# Altium schematic sheet Sheet1.SchDoc
size A; SheetNumber: 1; SheetTotal: 2
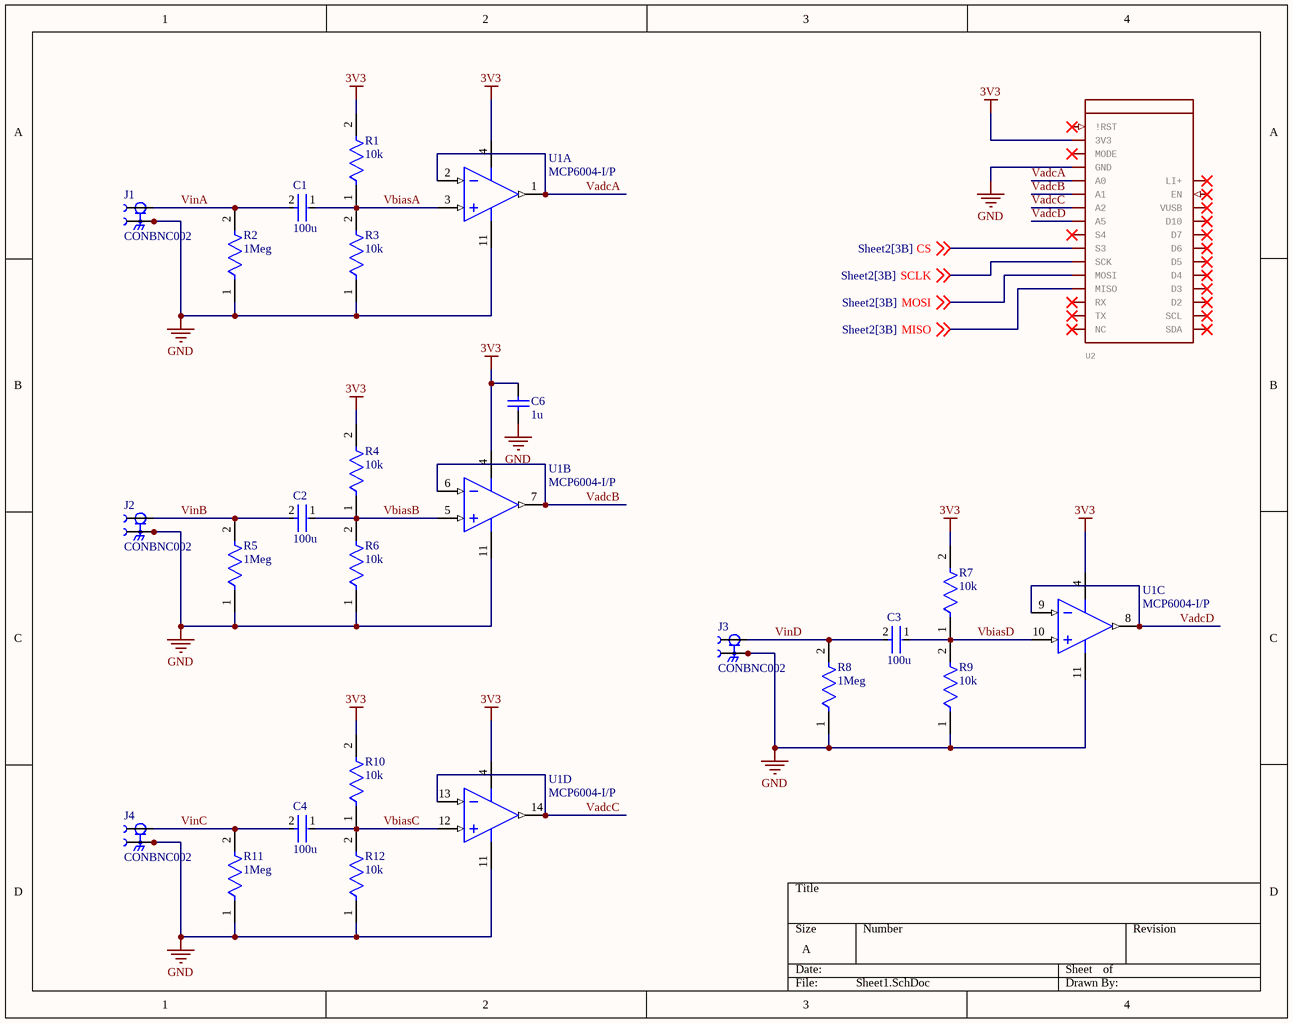
[diagram p0: Sheet1.SchDoc]

## Parts
C1  100u  [FP-GRM31C-0_3-e0_3_0_8-IPC_C]
C2  100u  [FP-GRM31C-0_3-e0_3_0_8-IPC_C]
C3  100u  [FP-GRM31C-0_3-e0_3_0_8-IPC_C]
C4  100u  [FP-GRM31C-0_3-e0_3_0_8-IPC_C]
C6  1u  [CAPC3216X110X50LL20T25]
J1  CONBNC002  [LINX_CONBNC002]
J2  CONBNC002  [LINX_CONBNC002]
J3  CONBNC002  [LINX_CONBNC002]
J4  CONBNC002  [LINX_CONBNC002]
R1  10k  [FP-CR1206-IPC_B]
R2  1Meg  [FP-CRCW1206-e3-MFG]
R3  10k  [FP-CR1206-IPC_B]
R4  10k  [FP-CR1206-IPC_B]
R5  1Meg  [FP-CRCW1206-e3-MFG]
R6  10k  [FP-CR1206-IPC_B]
R7  10k  [FP-CR1206-IPC_B]
R8  1Meg  [FP-CRCW1206-e3-MFG]
R9  10k  [FP-CR1206-IPC_B]
R10  10k  [FP-CR1206-IPC_B]
R11  1Meg  [FP-CRCW1206-e3-MFG]
R12  10k  [FP-CR1206-IPC_B]
U1  MCP6004-I/P  [PDIP300-P14]  (parts A,B,C,D of 4)
U2  Particle Photon 2 Wi-Fi enabled development kit   Footprint and formfactor based on Adafruit Feather.  [PHOTON2]  (value not drawn)

## Nets
3V3: C6.2 R1.2 R4.2 R7.2 R10.2 U1.4(VDD) U2.2(3V3)
GND: C6.1 J1.2 J1.S1 J1.S2 J2.2 J2.S1 J2.S2 J3.2 J3.S1 J3.S2 J4.2 J4.S1 J4.S2 R2.1 R3.1 R5.1 R6.1 R8.1 R9.1 R11.1 R12.1 U1.11(VSS) U2.4(GND)
CS: U2.10(S3) ; off-sheet CS
MISO: U2.13(MISO) ; off-sheet MISO
MOSI: U2.12(MOSI) ; off-sheet MOSI
SCLK: U2.11(SCK) ; off-sheet SCLK
VadcA: U1.1(VOUTA) U1.2(VINA-) U2.5(A0)
VadcB: U1.6(VINB-) U1.7(VOUTB) U2.6(A1)
VadcC: U1.13(VIND-) U1.14(VOUTD) U2.7(A2)
VadcD: U1.8(VOUTC) U1.9(VINC-) U2.8(A5)
VbiasA: C1.1 R1.1 R3.2 U1.3(VINA+)
VbiasB: C2.1 R4.1 R6.2 U1.5(VINB+)
VbiasC: C4.1 R10.1 R12.2 U1.12(VIND+)
VbiasD: C3.1 R7.1 R9.2 U1.10(VINC+)
VinA: C1.2 J1.1 R2.2
VinB: C2.2 J2.1 R5.2
VinC: C4.2 J4.1 R11.2
VinD: C3.2 J3.1 R8.2

Not connected (* = marked no-connect by the designer): U2 1(!RST)* 3(MODE)* 9(S4)* 14(RX)* 15(TX)* 16(NC)* 17(SDA)* 18(SCL)* 19(D2)* 20(D3)* 21(D4)* 22(D5)* 23(D6)* 24(D7)* 25(D10)* 26(VUSB)* 27(EN)* 28(LI+)*

## Library data of the parts
C1-C4 = CMP-06035-046129-1: Chip Multilayer Ceramic Capacitors for General Purpose, 1206, 100uF, X6T, +22%/-33%, 20%, 6.3V
C6 = CMP-2000-06011-1: Chip Capacitor, 1 uF, +/- 10%, 50 V, -55 to 125 degC, 1206 (3216 Metric), RoHS, Tape and Reel; Manufacturer: Kemet; Case Height: 1mm; Dielectric: X7R; Voltage Rating: 50V; Capacitance: 1uF; Temperature Coefficient / Code: +/-15%; Case Length: 3.2mm; Case Width: 1.6mm; Type: SMDMLCCX7R6.3-250VDCCommericalGrade; Class: Class1; Capacitance - nF: 1000nF; Datasheet URL: http://www.kemet.com/docfinder?Partnumber=C1206C105K5RACTU; Product Category: MultilayerCeramicCapacitorsMLCC-SMD/SMT; Termination Style: SMD/SMT; Dimensions: 1.6mmWx3.2mmLx1mmH; Voltage Rating DC: 50V; Datasheet Version: 02/2016; Packaging: Reel; Brand: Kemet; RoHS: Details; Minimum Operating Temperature: -55C; Operating Temperature Range: -55Cto+125C; Package Reference: 1206; Manufacturer URL: http://www.kemet.com/; Product: GeneralTypeMLCCs; Tolerance: 10%; Package Description: 2-Pin Surface Mount Device, Body 3.2 x 1.6 mm; Mounting Technology: SurfaceMount; Case Code - mm: 3216; Maximum Operating Temperature: +125C; Series: C1206C; Factory Pack Quantity: 2500; Package / Case: 1206(3216metric); Case Code - in: 1206
J1-J4 = CONBNC002: BNC Jack 50 Ohm PCB Through Hole; MF: Linx Technologies Inc.; SnapEDA_Link: https://www.snapeda.com/parts/CONBNC002/Linx/view-part/?ref=snap; Package: None; Value: *; MP: CONBNC002; Check_prices: https://www.snapeda.com/parts/CONBNC002/Linx/view-part/?ref=eda
R1 R3 R4 R6 R7 R9 R10 R12 = CMP-07231-005593-1: Thick Film Chip Resistors 1206 10kΩ 0.25W 5% 200ppm/°C; Voltage Rating: 200V; Resistance: 10kR; Max Power Dissipation: 250mW; Temperature Coefficient: 200ppm/°C; Height: 0.6mm; Case Code (Imperial): 1206; REACH SVHC: No SVHC; Depth: 1.6mm; Mount: Surface Mount; Termination: SMD/SMT; Case/Package: 1206; Min Operating Temperature: -55°C; Features: Moisture Resistant; Number of Pins: 2; Length: 3.2mm; Military Standard: Not; Radiation Hardening: No; Max Operating Temperature: 155°C; Power Rating: 250mW; Case Code (Metric): 3216; Package Quantity: 1; Composition: Thick Film; Tolerance: 5%; Voltage Rating (DC): 200V; Contact Plating: Tin; Thickness: 610um; Number of Terminations: 2; Packaging: Tape and Reel; Width: 1.6mm
R2 R5 R8 R11 = CMP-2003-01906-2: RES Thick Film, 1MΩ, 1%, 0.25W, 100ppm/°C, 1206; Voltage Rating (DC): 200V; Max Power Dissipation: 250mW; Resistance: 1MR; Package Quantity: 10; Case Code (Imperial): 1206; Weight: 0.000353oz; Height: 0.024inch; Number of Terminations: 2; Case/Package: 1206; Length: 3.2mm; Military Standard: Not; Features: Automotive AEC-Q200; Voltage Rating: 200V; Termination: SMD/SMT; Tolerance: 1%; Lead Free: Lead Free; Number of Pins: 2; Composition: Thick Film; Width: 0.063inch; Temperature Coefficient: 100ppm/°C; Packaging: Tape and Reel; Min Operating Temperature: -55°C; Max Operating Temperature: 155°C; Case Code (Metric): 3216; Contact Plating: Tin; Depth: 1.6mm; Radiation Hardening: No; Power Rating: 250mW; Working Voltage: 200V
U1 = CMP-0187-00122-3: None; Number of Elements: 4; Supply Current: 100uA; Input Bias Current: 1pA; Input Offset Voltage (Vos): 4.5mV; Min Supply Voltage: 1.8V; Unity Gain Bandwidth Product: 1MHz; Output Current: 23mA; Amplifier Type: GENERAL PURPOSE; Common Mode Rejection Ratio: 60dB; Max Supply Voltage: 6V; Slew Rate: 0.6V/µs; Voltage Gain: 112dB; Operating Supply Voltage: 5.5V; Power Supply Rejection Ratio (PSRR): 86dB; Number of Pins: 14; Radiation Hardening: No; Package Quantity: 30; Number of Circuits: 4; Technology: CMOS; Height: 3.3mm; Lead Free: Lead Free; RoHS Compliant: Yes; Input Offset Voltage-Max: 4.5mV; Min Operating Temperature: -40°C; Max Operating Temperature: 85°C; Length: 19.05mm; Packaging: Rail/Tube; Width: 6.35mm; Number of Amplifiers: 4; Number of Channels: 4; REACH SVHC: No SVHC; Mount: Through Hole; Output Current per Channel: 23mA; Slew Rate-Nom: 0.6V/µs; Case/Package: PDIP; Operating Supply Current: 100uA; Gain Bandwidth Product: 1MHz; Nominal Supply Current: 100uA
U2 = PHOTON2: GateName_1: G$1; SymbolName_1: PHOTON2; LibraryName: Particle-Devices; DeviceSetName: PHOTON2; Package: PHOTON2